# EAGLE schematic E-plan-Pool-control (EAGLE 6.6.0)

## Sheet 1 of 2
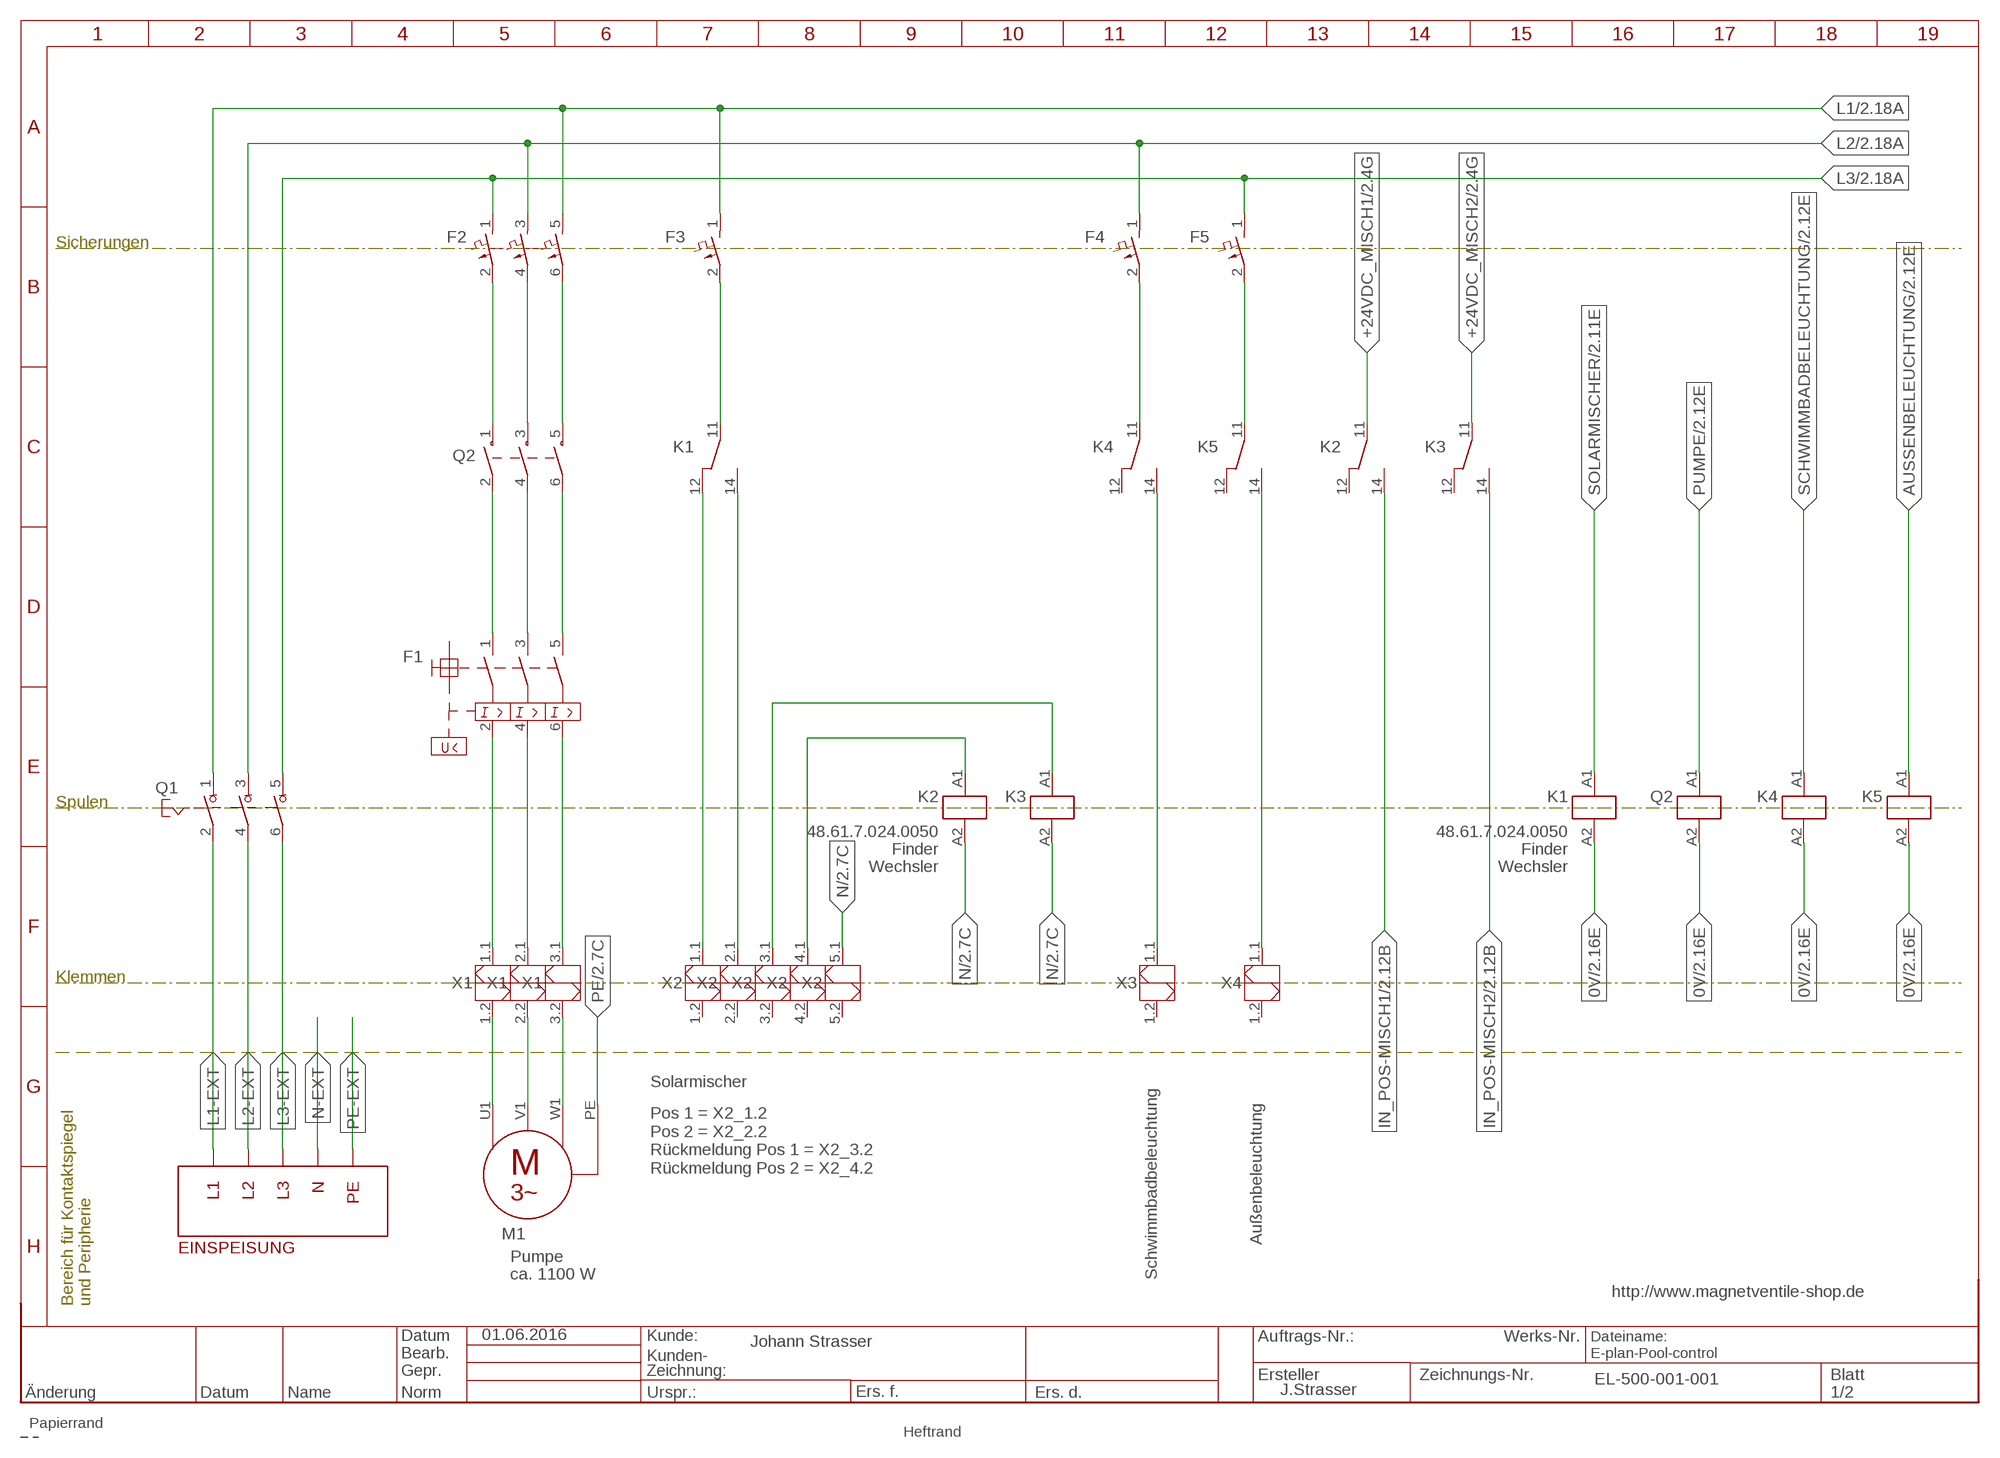
[diagram p0: schematic, sheet 1]
RAHMEN1 (RAHMEN_A4_8Z-19S): DATUM: 01.06.2016; ERSTELLER: J.Strasser; KUNDE: Johann Strasser; ZEICHNUNGS_NR: EL-500-001-001

### Parts
F1  MOTORSCHUTZSCHALTER_3-POL_MAG_UND_UNTERSPANNUNGS-AUSLOESUNG_HANDBETAETIGT  [MOTORSCHUTZSCHALTER_3-POL_MAG_UND_UNTERSPANNUNGS-AUSLOESUNG_HANDBETAETIGT]
F2  LEITUNGSSCHUTZSCHALTER_3-POL  [LEITUNGSSCHUTZSCHALTER_3-POL]
F3  LEITUNGSSCHUTZSCHALTER  [LEITUNGSSCHUTZSCHALTER]
F4  LEITUNGSSCHUTZSCHALTER  [LEITUNGSSCHUTZSCHALTER]
F5  LEITUNGSSCHUTZSCHALTER  [LEITUNGSSCHUTZSCHALTER]
K1  HILFSSCHUETZ_11-12-14  [HILFSSCHUETZ_11-12-14]
K2  HILFSSCHUETZ_11-12-14  [HILFSSCHUETZ_11-12-14]
K3  HILFSSCHUETZ_11-12-14  [HILFSSCHUETZ_11-12-14]
K4  HILFSSCHUETZ_11-12-14  [HILFSSCHUETZ_11-12-14]
K5  HILFSSCHUETZ_11-12-14  [HILFSSCHUETZ_11-12-14]
M1  MOTOR_3-POL_PE  [MOTOR_3-POL_PE]
Q1  LASTTRENNSCHALTER_3-POL  [LASTTRENNSCHALTER_3-POL]
Q2  HAUPTSCHUETZ_3-POL  [HAUPTSCHUETZ_3-POL]
X1  KLEMME-2_3-BRUECKE  [KLEMME-2_3-BRUECKE]
X2  KLEMME-2_5-BRUECKE  [KLEMME-2_5-BRUECKE]
X3  KLEMME-2_5-BRUECKE  [KLEMME-2_5-BRUECKE]
X4  KLEMME-2_5-BRUECKE  [KLEMME-2_5-BRUECKE]

### Nets
0V: K1.A2(0:A2) K4.A2(0:A2) K5.A2(0:A2) Q2.A2 ; also sheet 2
+24VDC_MISCH1: K2.11 ; also sheet 2
+24VDC_MISCH2: K3.11 ; also sheet 2
AUSSENBELEUCHTUNG: K5.A1(0:A1) ; also sheet 2
IN_POS-MISCH1: K2.14 ; also sheet 2
IN_POS-MISCH2: K3.14 ; also sheet 2
L1: F2.5 F3.1 Q1.1 ; also sheet 2
L1-EXT: Q1.2
L2: F2.3 F4.1 Q1.3 ; also sheet 2
L2-EXT: Q1.4
L3: F2.1 F5.1 Q1.5 ; also sheet 2
L3-EXT: Q1.6
N: K2.A2(0:A2) K3.A2(0:A2) X2.5.1 ; also sheet 2
N$1: M1.U1 X1.1.2
N$2: M1.V1 X1.2.2
N$3: M1.W1 X1.3.2
N$4: F1.2 X1.1.1
N$5: F1.4 X1.2.1
N$6: F1.6 X1.3.1
N$7: F2.2 Q2.1
N$8: F2.4 Q2.3
N$9: F2.6 Q2.5
N$10: F3.2 K1.11
N$11: K1.12 X2.1.1
N$12: K1.14 X2.2.1
N$13: F1.1 Q2.2
N$14: F1.3 Q2.4
N$15: F1.5 Q2.6
N$16: K3.A1(0:A1) X2.3.1
N$17: K2.A1(0:A1) X2.4.1
N$18: F4.2 K4.11
N$19: K4.14 X3.1.1
N$20: K5.14 X4.1.1
N$21: F5.2 K5.11
PE: M1.PE ; also sheet 2
PUMPE: Q2.A1 ; also sheet 2
SCHWIMMBADBELEUCHTUNG: K4.A1(0:A1) ; also sheet 2
SOLARMISCHER: K1.A1(0:A1) ; also sheet 2
Unconnected: K2.12 K3.12 K4.12 K5.12 X2.1.2 X2.2.2 X2.3.2 X2.4.2 X2.5.2 X3.1.2 X3.2.1 X3.2.2 X3.3.1 X3.3.2 X3.4.1 X3.4.2 X3.5.1 X3.5.2 X4.1.2 X4.2.1 X4.2.2 X4.3.1 X4.3.2 X4.4.1 X4.4.2 X4.5.1 X4.5.2

### Notes on the sheet
- Solarmischer
- Pos 1 = X2_1.2
  Pos 2 = X2_2.2
  Rückmeldung Pos 1 = X2_3.2
  Rückmeldung Pos 2 = X2_4.2
- Außenbeleuchtung
- Pumpe
- ca. 1100 W | Schwimmbadbeleuchtung
- http://www.magnetventile-shop.de

## Sheet 2 of 2
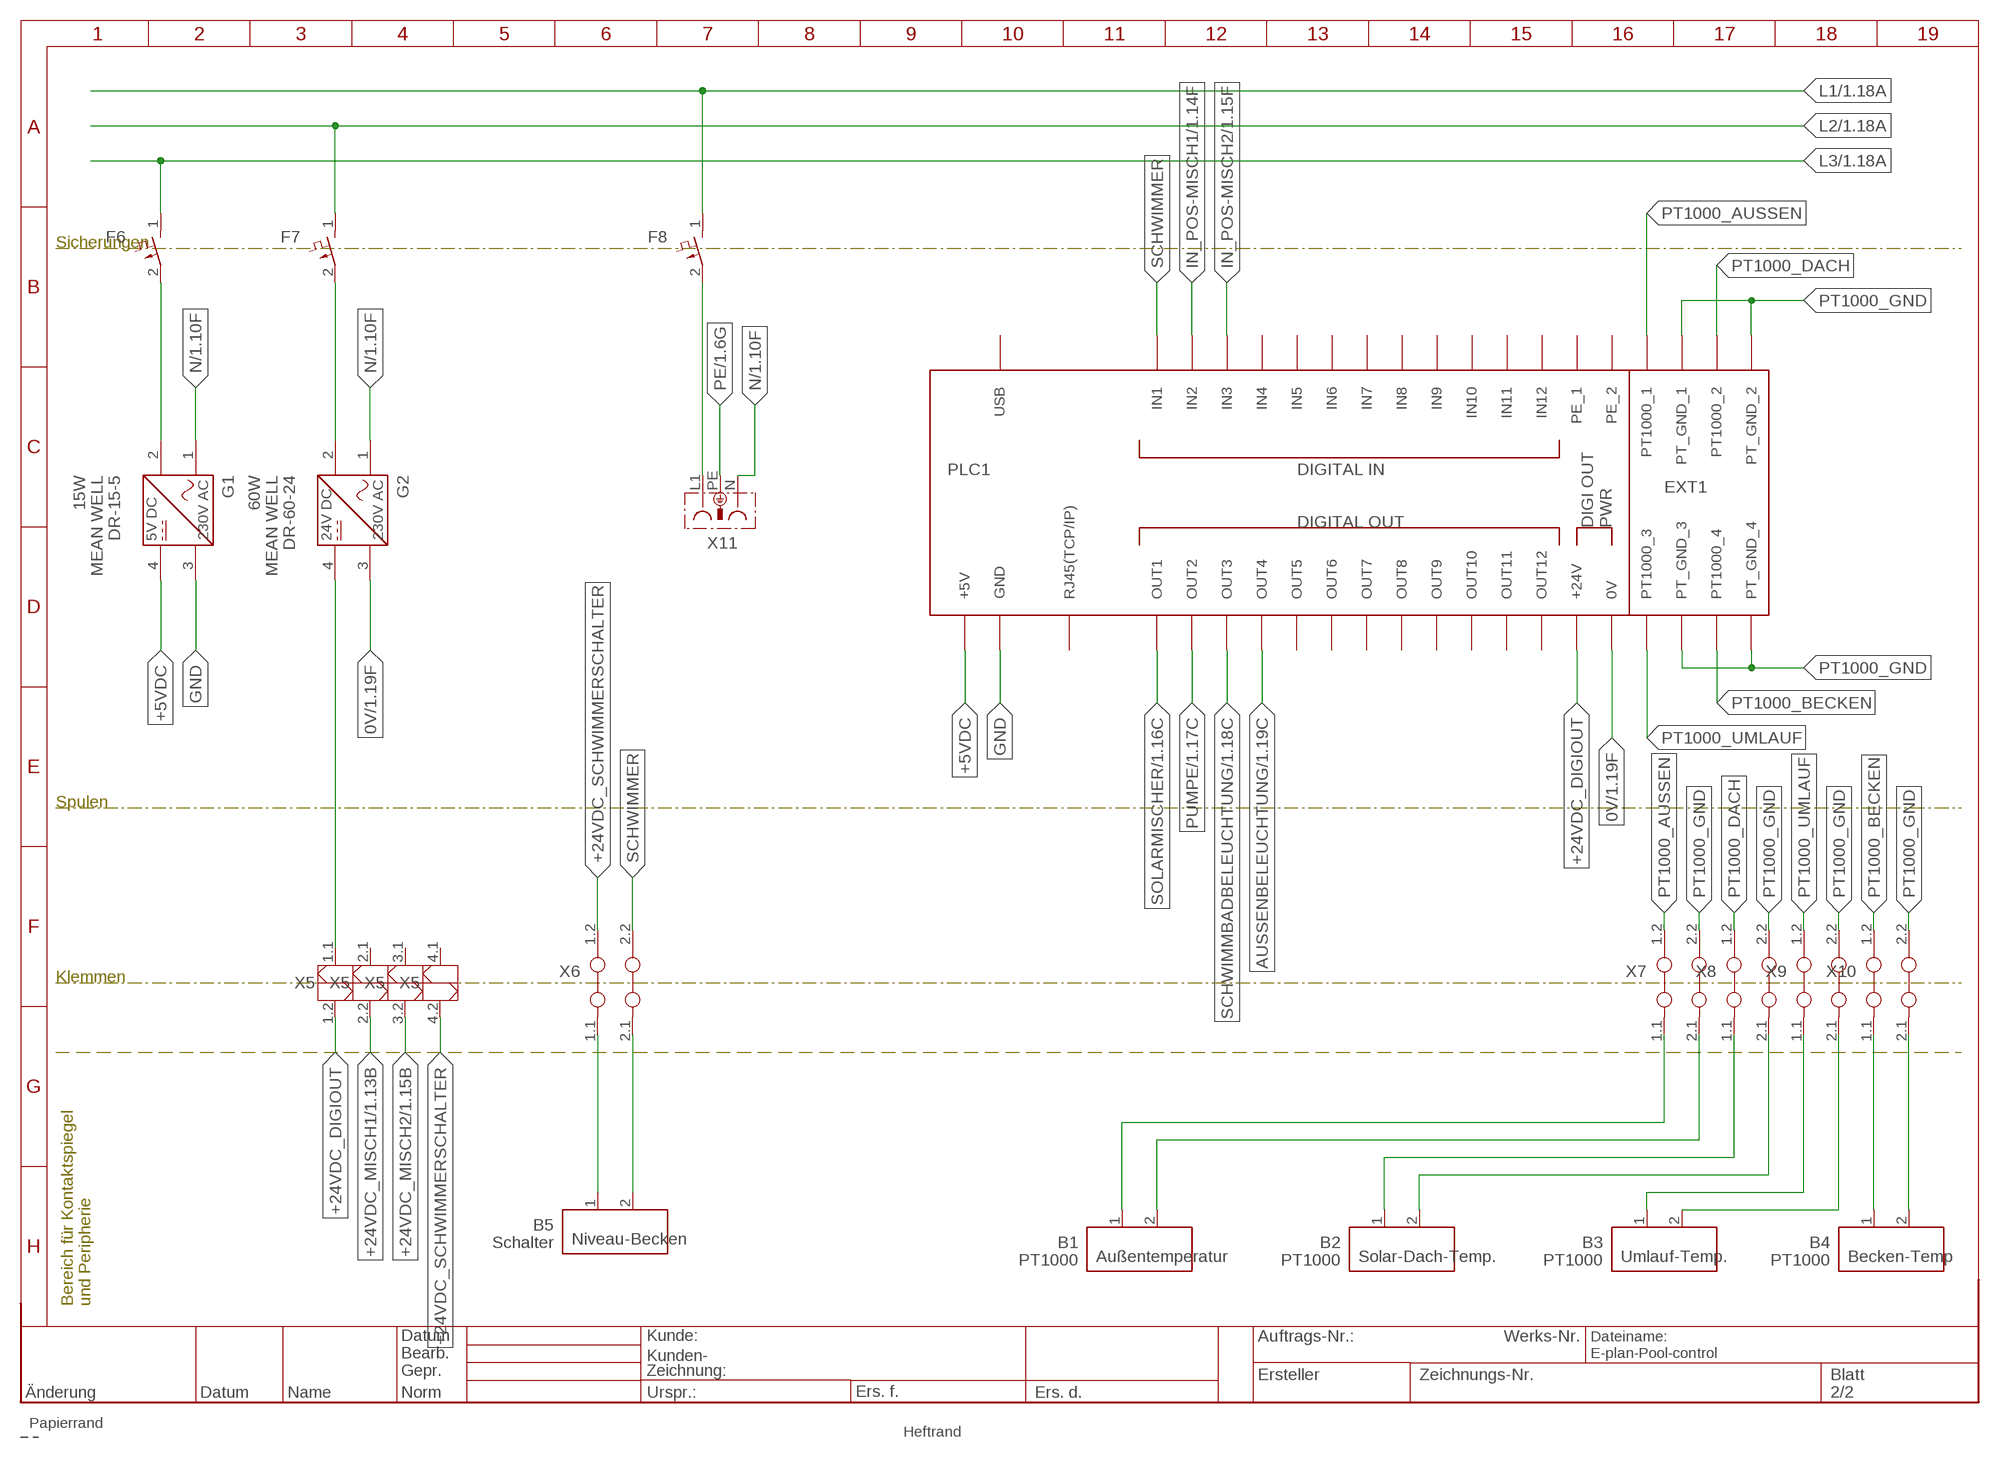
[diagram p1: schematic, sheet 2]

### Parts
B1  MESSFUEHLER_2  [MESSFUEHLER_2]
B2  MESSFUEHLER_2  [MESSFUEHLER_2]
B3  MESSFUEHLER_2  [MESSFUEHLER_2]
B4  MESSFUEHLER_2  [MESSFUEHLER_2]
B5  MESSFUEHLER_2  [MESSFUEHLER_2]
EXT1  DIN-PT1000-EXT  (no package)
F6  LEITUNGSSCHUTZSCHALTER  [LEITUNGSSCHUTZSCHALTER]
F7  LEITUNGSSCHUTZSCHALTER  [LEITUNGSSCHUTZSCHALTER]
F8  LEITUNGSSCHUTZSCHALTER  [LEITUNGSSCHUTZSCHALTER]
G1  NETZTEIL_GLEICHSPANNUNG  [NETZTEIL_GLEICHSPANNUNG]
G2  NETZTEIL_GLEICHSPANNUNG  [NETZTEIL_GLEICHSPANNUNG]
PLC1  DIN-RAIL-BASIS  (no package)
X5  KLEMME-2_4-BRUECKE  [KLEMME-2_4-BRUECKE]
X6  KLEMME_2-2  [KLEMME_2-2]
X7  KLEMME_2-2  [KLEMME_2-2]
X8  KLEMME_2-2  [KLEMME_2-2]
X9  KLEMME_2-2  [KLEMME_2-2]
X10  KLEMME_2-2  [KLEMME_2-2]
X11  STECKDOSE  [STECKDOSE]

### Nets
0V: G2.3 PLC1.0V ; also sheet 1
+5VDC: G1.4 PLC1.+5V
+24VDC: G2.4 X5.1.1
+24VDC_DIGIOUT: PLC1.+24V X5.1.2
+24VDC_MISCH1: X5.2.2 ; also sheet 1
+24VDC_MISCH2: X5.3.2 ; also sheet 1
+24VDC_SCHWIMMERSCHALTER: X5.4.2 X6.1.2
AUSSENBELEUCHTUNG: PLC1.OUT4 ; also sheet 1
GND: G1.3 PLC1.GND
IN_POS-MISCH1: PLC1.IN2 ; also sheet 1
IN_POS-MISCH2: PLC1.IN3 ; also sheet 1
L1: F8.1 ; also sheet 1
L2: F7.1 ; also sheet 1
L3: F6.1 ; also sheet 1
N: G1.1 G2.1 X11.N ; also sheet 1
N$22: F6.2 G1.2
N$23: F7.2 G2.2
N$24: B5.1 X6.1.1
N$25: F8.2 X11.L1
N$26: B1.1 X7.1.1
N$27: B5.2 X6.2.1
N$28: B1.2 X7.2.1
N$31: B2.1 X8.1.1
N$32: B2.2 X8.2.1
N$33: B3.1 X9.1.1
N$34: B3.2 X9.2.1
N$35: B4.1 X10.1.1
N$36: B4.2 X10.2.1
PE: X11.PE ; also sheet 1
PT1000_AUSSEN: EXT1.PT1000_1 X7.1.2
PT1000_BECKEN: EXT1.PT1000_4 X10.1.2
PT1000_DACH: EXT1.PT1000_2 X8.1.2
PT1000_GND: EXT1.PT_GND_1 EXT1.PT_GND_2 EXT1.PT_GND_3 EXT1.PT_GND_4 X7.2.2 X8.2.2 X9.2.2 X10.2.2
PT1000_UMLAUF: EXT1.PT1000_3 X9.1.2
PUMPE: PLC1.OUT2 ; also sheet 1
SCHWIMMBADBELEUCHTUNG: PLC1.OUT3 ; also sheet 1
SCHWIMMER: PLC1.IN1 X6.2.2
SOLARMISCHER: PLC1.OUT1 ; also sheet 1
Unconnected: PLC1.IN4 PLC1.IN5 PLC1.IN6 PLC1.IN7 PLC1.IN8 PLC1.IN9 PLC1.IN10 PLC1.IN11 PLC1.IN12 PLC1.OUT5 PLC1.OUT6 PLC1.OUT7 PLC1.OUT8 PLC1.OUT9 PLC1.OUT10 PLC1.OUT11 PLC1.OUT12 PLC1.PE_1 PLC1.PE_2 PLC1.RJ45(TCP/IP) PLC1.USB X5.2.1 X5.3.1 X5.4.1

## Library data of the parts
B1 = e-messfuehler:MESSFUEHLER_2: Messfühler mit zwei Anschlüssen; FUNKTION: Außentemperatur; TYPE: PT1000
B2 = e-messfuehler:MESSFUEHLER_2: Messfühler mit zwei Anschlüssen; FUNKTION: Solar-Dach-Temp.; TYPE: PT1000
B3 = e-messfuehler:MESSFUEHLER_2: Messfühler mit zwei Anschlüssen; FUNKTION: Umlauf-Temp.; TYPE: PT1000
B4 = e-messfuehler:MESSFUEHLER_2: Messfühler mit zwei Anschlüssen; FUNKTION: Becken-Temp; TYPE: PT1000
B5 = e-messfuehler:MESSFUEHLER_2: Messfühler mit zwei Anschlüssen; FUNKTION: Niveau-Becken; TYPE: Schalter
EXT1 = STRASYS_CONTRL:DIN-PT1000-EXT: DIN-Rail-controller PT1000 extension
F1 = e-motorschutzschalter:MOTORSCHUTZSCHALTER_3-POL_MAG_UND_UNTERSPANNUNGS-AUSLOESUNG_HANDBETAETIGT: Motorschutzschalter mit Fehlerspannungsauslösung; FUNKTION: Motorschutzschalter
F2 = e-sicherungen:LEITUNGSSCHUTZSCHALTER_3-POL: Leitungsschutzschalter, 3-pol.; FUNKTION: Motorsicherung
F3-F8 = e-sicherungen:LEITUNGSSCHUTZSCHALTER: Sicherung
G1 = e-stromversorgungselemente:NETZTEIL_GLEICHSPANNUNG: Netzteil, Gleichspannung; AUSGANGSSPANNUNG: 5V DC; EINGANGSSPANNUNG: 230V AC; FUNKTION: 15W; HERSTELLER: MEAN WELL; TYPE: DR-15-5
G2 = e-stromversorgungselemente:NETZTEIL_GLEICHSPANNUNG: Netzteil, Gleichspannung; AUSGANGSSPANNUNG: 24V DC; EINGANGSSPANNUNG: 230V AC; FUNKTION: 60W; HERSTELLER: MEAN WELL; TYPE: DR-60-24
K1 K2 = e-schuetze-relais:HILFSSCHUETZ_11-12-14: Hilfsschütz mit Wechselkontakt; FUNKTION: Wechsler; HERSTELLER: Finder; TYPE: 48.61.7.024.0050
K3-K5 = e-schuetze-relais:HILFSSCHUETZ_11-12-14: Hilfsschütz mit Wechselkontakt
M1 = e-motoren:MOTOR_3-POL_PE: 3-Phasen-Motor mit PE
PLC1 = STRASYS_CONTRL:DIN-RAIL-BASIS: DIN-RAil-controller basis
Q1 = e-schalter:LASTTRENNSCHALTER_3-POL: Lasttrennschalter, 3-pol.; FUNKTION: Lasttrennschalter
Q2 = e-schuetze-relais:HAUPTSCHUETZ_3-POL: Hauptschütz mit 3 Schließern
X1 = e-klemmen:KLEMME-2_3-BRUECKE: Klemme 3-pol. mit Brückenhinweis
X2-X4 = e-klemmen:KLEMME-2_5-BRUECKE: Klemme 5-pol. mit Brückenhinweis
X5 = e-klemmen:KLEMME-2_4-BRUECKE: Klemme 4-pol. mit Brückenhinweis
X6-X10 = e-klemmen:KLEMME_2-2: Klemme 2 2
X11 = e-steckverbinder:STECKDOSE: Steckdose mit Schutzleiter